# EAGLE design iLight (EAGLE 8.7.0)
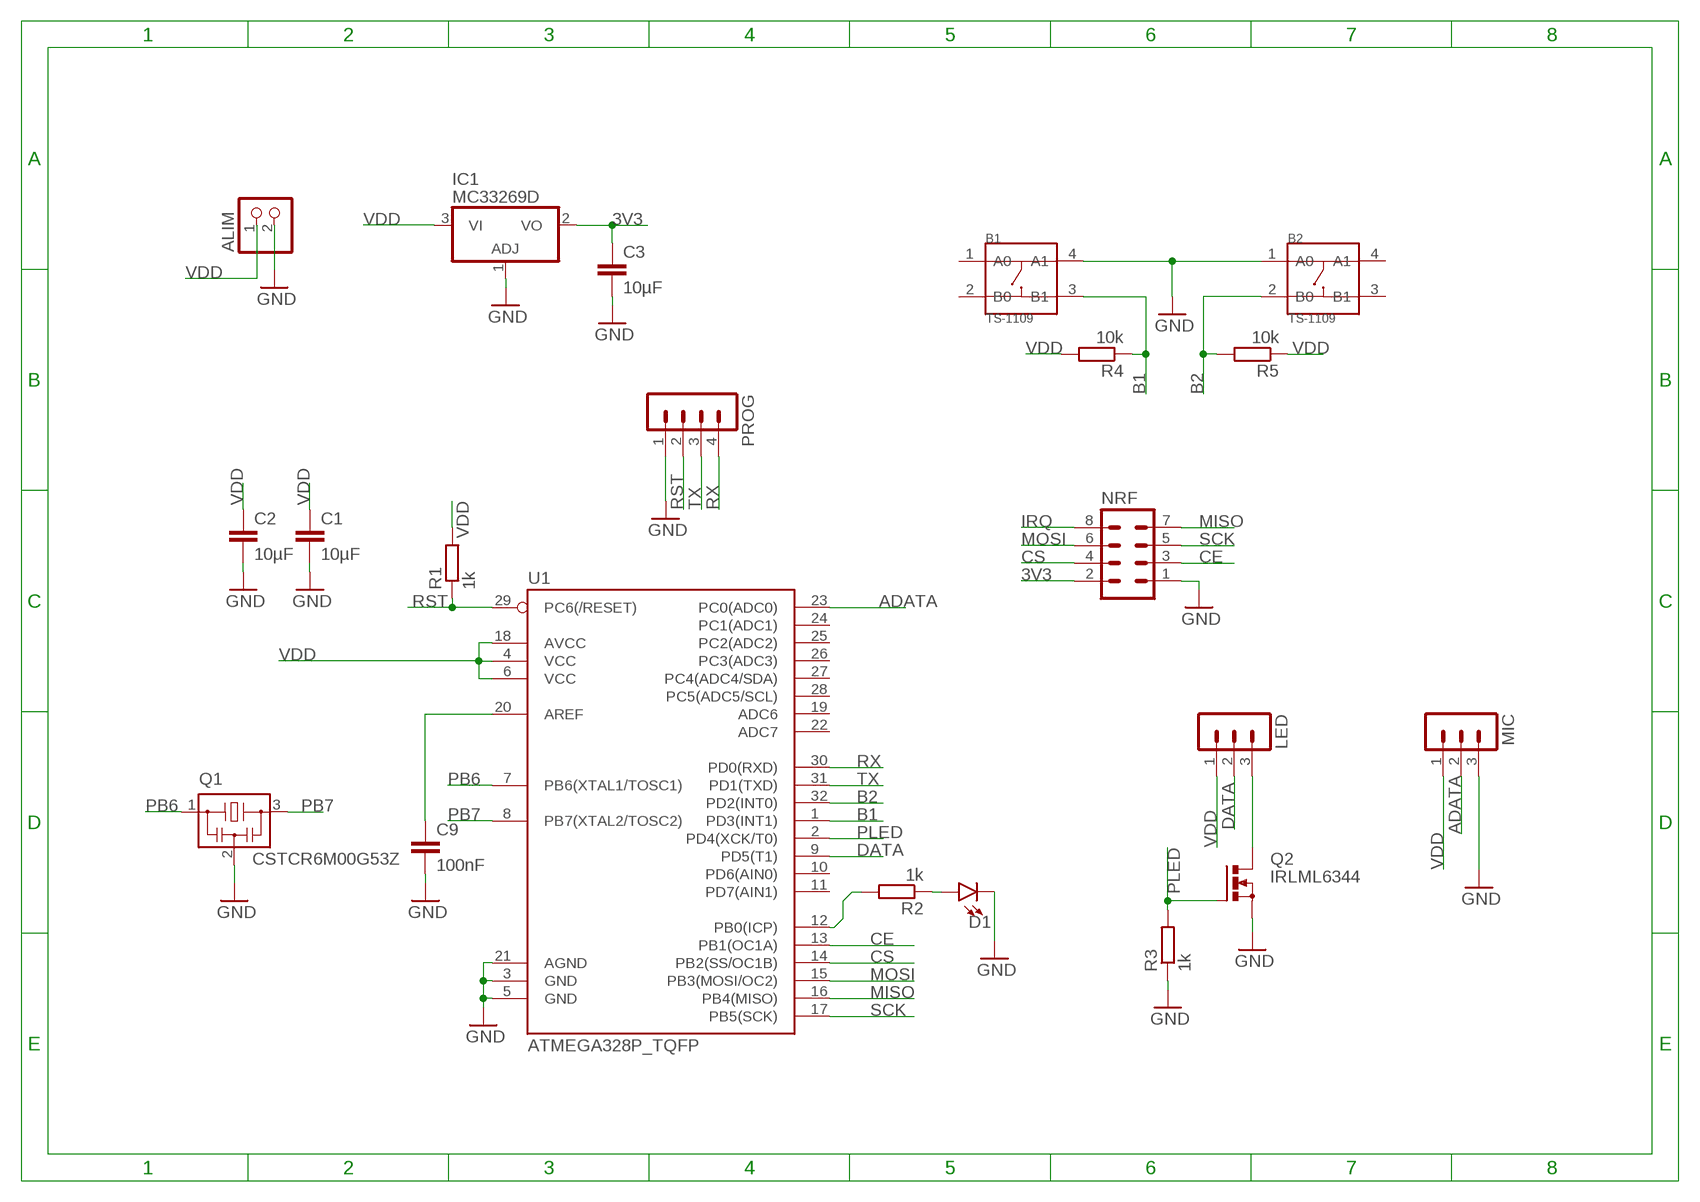
[diagram p0: schematic, sheet 1]

## Parts
ALIM  PINHD-1X2  [1X02]
B1  TS-1109  DIP-BUTTON-4P  [SW4-6.0X6.0X5.0MM]
B2  TS-1109  DIP-BUTTON-4P  [SW4-6.0X6.0X5.0MM]
C1  10µF  C-EUC1206  [C1206]
C2  10µF  C-EUC1206  [C1206]
C3  10µF  C-EUC1206  [C1206]
C9  100nF  C-EUC1206  [C1206]
D1  LED-FKIT-1206  [FKIT-LED-1206]
IC1  MC33269D  [DPACK]
LED  MA03-1  [MA03-1]
MIC  MA03-1  [MA03-1]
NRF  MA04-2  [MA04-2]
PROG  MA04-1  [MA04-1]
Q1  CSTCR6M00G53Z  [CSTCR6M]
Q2  IRLML6344  [SOT-23]
R1  1k  R-EU_R1206  [R1206]
R2  1k  R-EU_R1206  [R1206]
R3  1k  R-EU_R1206  [R1206]
R4  10k  R-EU_R1206  [R1206]
R5  10k  R-EU_R1206  [R1206]
U1  ATMEGA328P_TQFP  [TQFP32-08]

## Nets
3V3: C3.1 IC1.2(VO) NRF.2
ADATA: MIC.2 U1.23(PC0(ADC0))
B1: B1.3(B1) R4.1 U1.1(PD3(INT1))
B2: B2.2(B0) R5.2 U1.32(PD2(INT0))
CE: NRF.3 U1.13(PB1(OC1A))
CS: NRF.4 U1.14(PB2(SS/OC1B))
DATA: LED.2 U1.9(PD5(T1))
GND: ALIM.2 B1.4(A1) B2.1(A0) C1.2 C2.2 C3.2 C9.2 D1.C IC1.1(ADJ) MIC.3 NRF.1 PROG.1 Q1.2 Q2.P2(S) R3.1 U1.3(GND) U1.5(GND) U1.21(AGND)
IRQ: NRF.8
MISO: NRF.7 U1.16(PB4(MISO))
MOSI: NRF.6 U1.15(PB3(MOSI/OC2))
N$1: C9.1 U1.20(AREF)
N$2: LED.3 Q2.P3(D)
N$5: R2.2 U1.12(PB0(ICP))
N$6: D1.A R2.1
PB6: Q1.1 U1.7(PB6(XTAL1/TOSC1))
PB7: Q1.3 U1.8(PB7(XTAL2/TOSC2))
PLED: Q2.P1(G) R3.2 U1.2(PD4(XCK/T0))
RST: PROG.2 R1.1 U1.29(PC6(/RESET))
RX: PROG.4 U1.30(PD0(RXD))
SCK: NRF.5 U1.17(PB5(SCK))
TX: PROG.3 U1.31(PD1(TXD))
VDD: ALIM.1 C1.1 C2.1 IC1.3(VI) LED.1 MIC.1 R1.2 R4.2 R5.1 U1.4(VCC) U1.6(VCC) U1.18(AVCC)
Unconnected: B1.1(A0) B1.2(B0) B2.3(B1) B2.4(A1) U1.10(PD6(AIN0)) U1.11(PD7(AIN1)) U1.19(ADC6) U1.22(ADC7) U1.24(PC1(ADC1)) U1.25(PC2(ADC2)) U1.26(PC3(ADC3)) U1.27(PC4(ADC4/SDA)) U1.28(PC5(ADC5/SCL))

## Library data of the parts
ALIM = pinhead:PINHD-1X2: PIN HEADER
B1 B2 = Seeed-OPL-Button:DIP-BUTTON-4P: 311020024; MPN: TS-1109
C1-C3 C9 = resistor:C-EU: CAPACITOR, European symbol
D1 = SparkFun-LED:LED: LED (Generic) Standard schematic elements and footprints for 5mm, 3mm, 1206, and 0603 sized LEDs. Generic LEDs with no color specified.
IC1 = linear:MC33269?*: Adjustable Output Low Dropout Voltage Regulator 800 mA Source: http://www.onsemi.com/pub/Collateral/MC33269-D.PDF
LED MIC = con-lstb:MA03-1: PIN HEADER; OC_FARNELL: unknown; OC_NEWARK: unknown
NRF = con-lstb:MA04-2: PIN HEADER; OC_FARNELL: unknown; OC_NEWARK: unknown
PROG = con-lstb:MA04-1: PIN HEADER; OC_FARNELL: unknown; OC_NEWARK: unknown
Q1 = murata-filter:CSTCR: Resonator Source: murata.co.jp; MPN: CSTCR6M00G53-R0; OC_FARNELL: 1170434; OC_NEWARK: 25M8759
Q2 = mosfet:IRLML6344: Nch MOSFET IRLML6344 30V 5A http://akizukidenshi.com/catalog/g/gI-06049/ I-06049
R1-R5 = resistor:R-EU_: RESISTOR, European symbol
U1 = SparkFun-IC-Microcontroller:ATMEGA328P_TQFP: Popular 328P in QFP Storefront component: ATmega328 - TQFP <https://www.sparkfun.com/products/13448> (COM-13448) Datasheet <http://www.sparkfun.com/datasheets/Components/SMD/ATMega328.pdf> SparkFun Products SparkFun RedBoard - Programmed with Arduino <https://www.sparkfun.com/products/12757> (DEV-12757) Arduino Pro Mini 328 - 5V/16MHz <https://www.sparkfun.com/products/11113> (DEV-11113) Arduino Pro Mini 328 - 3.3V/8MHz <https://www.sparkfun.com/products/11114> (DEV-11114) SparkFun OpenLog <https://www.sparkfun.com/products/13712> (DEV-13712) SparkFun MicroView - OLED Arduino Module <https://www.sparkfun.com/products/12923> (DEV-12923) SparkFun Digital Sandbox <https://www.sparkfun.com/products/12651> (DEV-12651) SparkFun PicoBoard <https://www.sparkfun.com/products/11888> (WIG-11888) Arduino Fio <https://www.sparkfun.com/products/10116> (DEV-10116) LilyPad Arduino 328 Main Board <https://www.sparkfun.com/products/13342> (DEV-13342) SparkFun RedStick <https://www.sparkfun.com/products/13741> (DEV-13741) LilyPad MP3 <https://www.sparkfun.com/products/11013> (DEV-11013) LilyPad Arduino SimpleSnap <https://www.sparkfun.com/products/10941> (DEV-10941) SparkFun Stepoko <https://www.sparkfun.com/products/13899> (ROB-13899) SparkFun Geiger Counter <https://www.sparkfun.com/products/11345> (SEN-11345) SparkFun EL Sequencer <https://www.sparkfun.com/products/12781> (COM-12781) Arduino Pro 328 - 5V/16MHz <https://www.sparkfun.com/products/10915> (DEV-10915) CryptoCape <https://www.sparkfun.com/products/12773> (DEV-12773) SparkFun IR Thermometer Evaluation Board - MLX90614 <https://www.sparkfun.com/products/10740> (SEN-10740) SparkFun RedBot Mainboard <https://www.sparkfun.com/products/12097> (ROB-12097) Arduino Pro 328 - 3.3V/8MHz <https://www.sparkfun.com/products/10914> (DEV-10914) SparkFun Block for Intel® Edison - Arduino <https://www.sparkfun.com/products/13036> (DEV-13036) SparkFun Simon Says - Surface Mount Soldering Kit <https://www.sparkfun.com/products/10935> (KIT-10935) SparkFun 7-Segment Serial Display - Red <https://www.sparkfun.com/products/11441> (COM-11441) SparkFun 7-Segment Serial Display - White <https://www.sparkfun.com/products/11629> (COM-11629) SparkFun 7-Segment Serial Display - Yellow <https://www.sparkfun.com/products/11443> (COM-11443) SparkFun 7-Segment Serial Display - Kelly Green <https://www.sparkfun.com/products/11440> (COM-11440) SparkFun 7-Segment Serial Display - Blue <https://www.sparkfun.com/products/11442> (COM-11442) SparkFun OpenSegment Serial Display - 20mm (Blue) <https://www.sparkfun.com/products/11647> (COM-11647) SparkFun OpenSegment Serial Display - 20mm (Green) <https://www.sparkfun.com/products/11646> (COM-11646) SparkFun OpenSegment Serial Display - 20mm (White) <https://www.sparkfun.com/products/11648> (COM-11648) SparkFun OpenSegment Serial Display - 20mm (Red) <https://www.sparkfun.com/products/11644> (COM-11644) SparkFun OpenSegment Serial Display - 20mm (Yellow) <https://www.sparkfun.com/products/11645> (COM-11645) SparkFun OpenSegment Shield <https://www.sparkfun.com/products/13190> (DEV-13190); PROD_ID: IC-09069

## Board
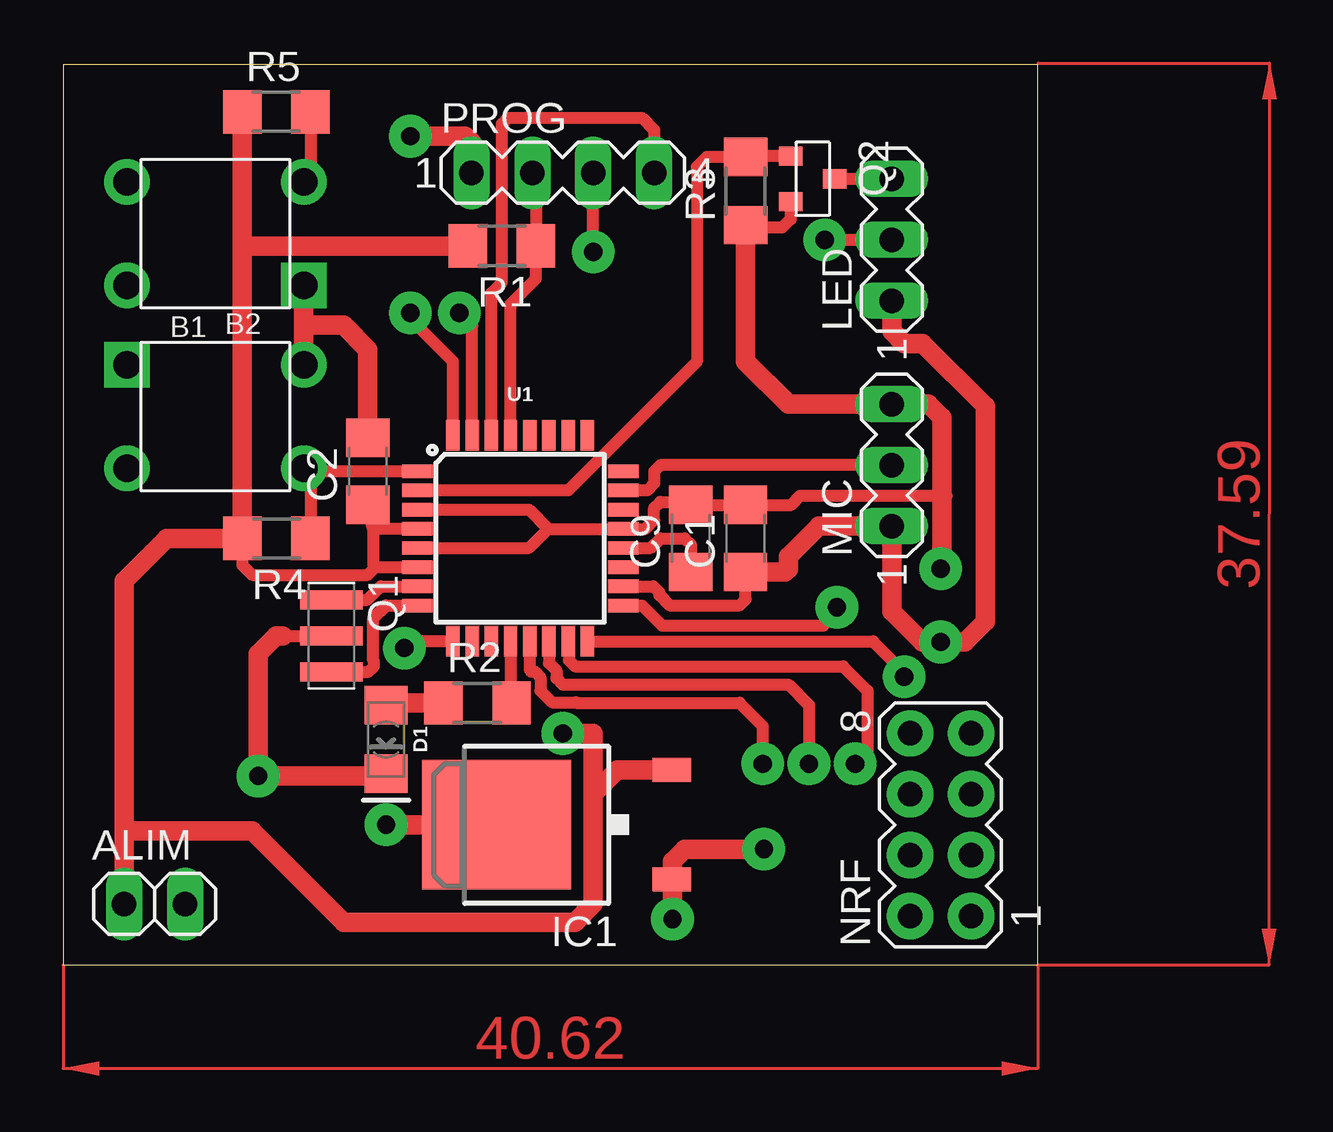
[diagram p1: board, top side]
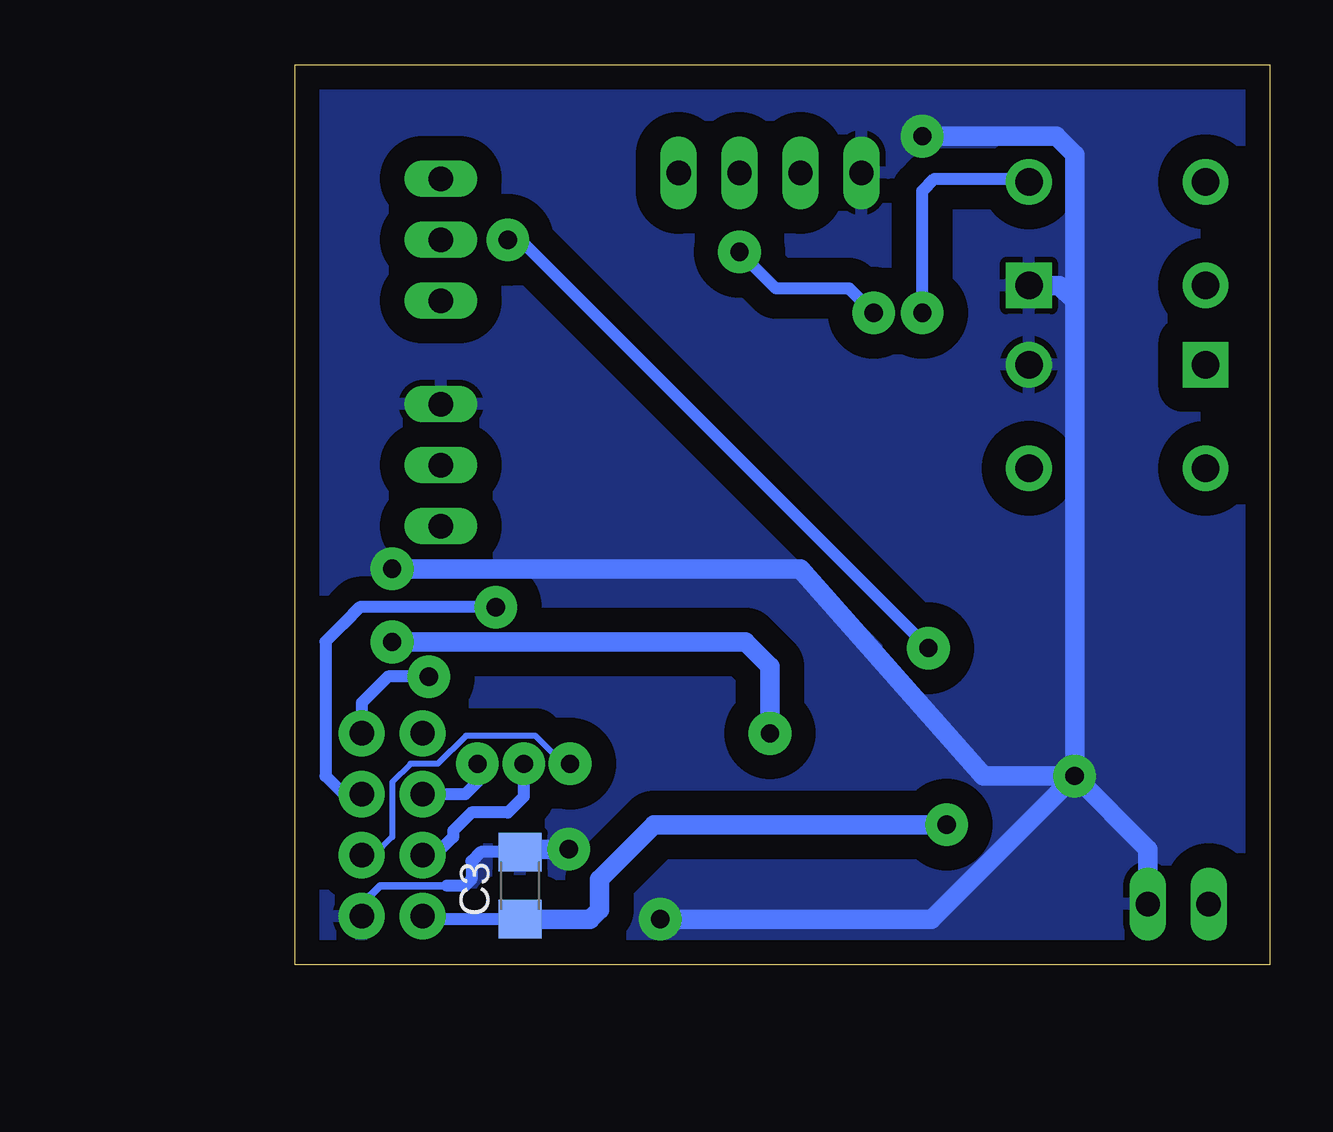
[diagram p2: board, bottom side, seen from below]

Size 40.62 x 37.52 mm. Coordinates in mm from the lower left corner, seen from the top.
Outline: 0,0 40.62,0 40.62,37.52 0,37.52 0,0
Copper layers (1*16): Top 0.035mm / dielectric 1.5mm / Bottom 0.035mm
Design rules "default": minimum track width 6mil, minimum drill 0.35mm, track to track 6mil, track to pad 6mil, pad to pad 6mil, via to via 6mil, smd to smd 6mil, copper to edge 40mil, drill to drill 6mil, minimum pad ring 10mil, minimum via ring 8mil, stop-mask expansion 4mil, vias tented up to drill 0mil, thermal gap 10mil

### Footprints (pad centres in the part's own frame; a part is rotated, then mirrored left to right if it is on the bottom)
1X02 = drill 1.016 long: 1 -1.27,0; 2 1.27,0
SW4-6.0X6.0X5.0MM = drill 1.143 pad 1.905 square: 1 -3.683,2.159 | drill 1.143 pad 1.905: 2 -3.683,-2.159; 3 3.683,-2.159; 4 3.683,2.159
C1206 = smd 1.6 x 1.8: 1 -1.4,0; 2 1.4,0
FKIT-LED-1206 = smd 1.6 x 1.803: A -1.422,0; C 1.422,0
DPACK = smd 1 x 1.6: 1 -2.28,-4.8; 3 2.28,-4.8 | smd 5.4 x 6.2: 2 0,2.5
MA03-1 = drill 1.016 long: 1 -2.54,0; 2 0,0; 3 2.54,0
MA04-2 = drill 1.016 pad 1.93: 1 -3.81,-1.27; 2 -3.81,1.27; 3 -1.27,-1.27; 4 -1.27,1.27; 5 1.27,-1.27; 6 1.27,1.27; 7 3.81,-1.27; 8 3.81,1.27
MA04-1 = drill 1.016 long: 1 -3.81,0; 2 -1.27,0; 3 1.27,0; 4 3.81,0
CSTCR6M = smd 0.8 x 2.6: 1 -1.5,0; 2 0,0; 3 1.5,0
SOT-23 = smd 0.802 x 0.972: P1 -0.95,-0.917; P2 0.95,-0.917; P3 0,0.917
R1206 = smd 1.6 x 1.803: 1 -1.422,0; 2 1.422,0
TQFP32-08 = smd 1.27 x 0.559: 1 -4.293,2.8; 2 -4.293,2; 3 -4.293,1.2; 4 -4.293,0.4; 5 -4.293,-0.4; 6 -4.293,-1.2; 7 -4.293,-2; 8 -4.293,-2.8; 17 4.293,-2.8; 18 4.293,-2; 19 4.293,-1.2; 20 4.293,-0.4; 21 4.293,0.4; 22 4.293,1.2; 23 4.293,2; 24 4.293,2.8 | smd 0.559 x 1.27: 9 -2.8,-4.293; 10 -2,-4.293; 11 -1.2,-4.293; 12 -0.4,-4.293; 13 0.4,-4.293; 14 1.2,-4.293; 15 2,-4.293; 16 2.8,-4.293; 25 2.8,4.293; 26 2,4.293; 27 1.2,4.293; 28 0.4,4.293; 29 -0.4,4.293; 30 -1.2,4.293; 31 -2,4.293; 32 -2.8,4.293

### Placement (x,y rotation side)
ALIM  3.81,2.54 0 top
B1  6.35,22.86 0 top
B2  6.35,30.48 180 top
C1  28.45,17.78 90 top
C2  12.7,20.57 90 top
C3  31.24,3.3 90 bottom
C9  26.16,17.78 90 top
D1  13.46,9.4 270 top
IC1  20.57,5.84 90 top
LED  34.54,30.23 90 top
MIC  34.54,20.83 90 top
NRF  36.58,5.84 90 top
PROG  20.83,33.02 0 top
Q1  11.18,13.72 270 top
Q2  31.24,32.77 270 top
R1  18.29,29.97 180 top
R2  17.27,10.92 0 top
R3  28.45,32.26 90 top
R4  8.89,17.78 180 top
R5  8.89,35.56 0 top
U1  19.05,17.78 0 top

### Tracks (layer width: path | path; a pad name or v marks a point on that pad's centre or on a via)
3V3  (via drill 0.76 pad 1.78)
  Top 0.813: IC1.2 v13.46,5.84
  Bottom 0.508: C3.1 35.18,1.9 NRF.2
  Bottom 0.813: v13.46,5.84 25.65,5.84 27.94,3.56 27.94,2.29 28.32,1.9 C3.1
ADATA
  Top 0.508: MIC.2 24.89,20.83 24.64,20.57 24.64,20.07 24.35,19.78 U1.23
B1
  Top 0.508: U1.1 10.15,20.58 B1.3 10.31,20.42 R4.1
B2  (via drill 0.76 pad 1.78)
  Top 0.508: U1.32 16.25,25.15 14.48,26.92 v14.48,27.18 | R5.2 10.31,32.92 B2.2
  Bottom 0.508: v14.48,27.18 14.48,32.26 13.97,32.77 10.16,32.77 B2.2
CE  (via drill 0.76 pad 1.78)
  Top 0.508: U1.13 19.45,12.3 19.52,12.23 19.66,12.23 19.9,11.99 19.9,11.43 20.38,10.95 21.36,10.95 21.39,10.92 28.19,10.92 29.16,9.96 v29.16,8.38
  Bottom 0.254: v29.16,8.38 29.44,8.38 30.61,9.55 33.5,9.55 34.67,8.38 35.81,8.38 36.58,7.62 36.58,5.33 37.34,4.57 NRF.3
CS  (via drill 0.76 pad 1.78)
  Top 0.508: U1.14 20.25,12.58 20.56,12.27 20.56,11.95 20.83,11.68 30.23,11.68 31.09,10.82 v31.09,8.38
  Bottom 0.508: v31.09,8.38 31.09,7.01 31.75,6.35 33.27,6.35 34.04,5.59 34.04,5.33 34.8,4.57 NRF.4
DATA  (via drill 0.76 pad 1.78)
  Top 0.508: U1.9 14.5,13.49 v14.22,13.21 | v31.75,30.23 LED.2
  Bottom 0.508: v14.22,13.21 31.24,30.23 v31.75,30.23
GND  (via drill 0.76 pad 1.78)
  Top 0.508: U1.5 19.41,17.38 20.21,18.18 | U1.3 19.41,18.98 20.21,18.18 | Q2.P2 30.32,31.09 29.97,30.73 28.55,30.73 R3.1 | 9.14,13.72 Q1.2 | 13.36,7.87 D1.C | 36.83,19.56 36.63,19.56 30.73,19.56 30.36,19.18 C1.2 C9.2 25.78,19.56 25.65,19.56 25.4,19.3 24.89,19.3 24.64,19.05 24.64,18.54 24.28,18.18 U1.21 20.21,18.18
  Top 0.813: 9.14,13.72 8.89,13.72 8.13,12.95 v8.13,7.87 13.36,7.87 | v25.4,1.91 25.4,3.54 IC1.1 25.4,3.59 25.4,4.32 25.91,4.83 v29.21,4.83 | B1.4 10.03,26.67 | 10.03,26.67 B2.1 | R3.1 28.45,25.15 30.23,23.37 MIC.3 36.07,23.37 36.63,22.81 36.63,19.56 36.63,16.56 v36.58,16.51 | v14.48,34.54 16.76,34.54 17.02,34.29 PROG.1 | C2.2 12.7,25.65 11.68,26.67 10.03,26.67
  Bottom 0.305: NRF.1 37.85,2.54 37.08,3.3 34.29,3.3
  Bottom 0.508: C3.2 32.89,4.7 33.27,4.32 33.27,3.56 33.53,3.3 34.29,3.3
  Bottom 0.813: ALIM.2 5.08,4.83 v8.13,7.87 | v8.13,7.87 14.1,1.91 v25.4,1.91 | v29.21,4.83 31.12,4.83 C3.2 | v36.58,16.51 19.56,16.51 11.94,7.87 v8.13,7.87 | v8.13,7.87 8.13,27.69 | B2.1 8.76,28.32 8.13,27.69 | 8.13,27.69 8.13,33.78 8.89,34.54 v14.48,34.54
  pour Bottom (isolate 1.016): 0,37.59 40.64,37.59 40.64,0 0,0
MISO  (via drill 0.76 pad 1.78)
  Top 0.508: U1.16 33.76,13.49 35.05,12.19 v35.05,12.01
  Bottom 0.508: v35.05,12.01 36.75,12.01 37.85,10.92 NRF.7
MOSI  (via drill 0.76 pad 1.78)
  Top 0.508: U1.15 21.08,13.46 21.08,12.7 21.34,12.45 32.51,12.45 33.53,11.43 33.53,8.89 v33.02,8.38
  Bottom 0.508: v33.02,8.38 33.02,7.62 33.53,7.11 NRF.6
N$1
  Top 0.508: U1.20 24.49,17.38 24.89,17.78 25.91,17.78 26.16,17.53 C9.1
N$2
  Top 0.508: Q2.P3 LED.3
N$5
  Top 0.508: U1.12 18.65,10.97 R2.2
N$6
  Top 0.813: D1.A 13.56,10.92 R2.1
PB6
  Top 0.508: Q1.1 12.68,15.22 13.24,15.78 U1.7
PB7
  Top 0.508: Q1.3 12.72,12.22 12.95,12.45 12.95,12.65 12.93,12.67 12.93,14.45 13.46,14.99 13.47,14.98 U1.8
PLED
  Top 0.508: Q2.P1 28.48,33.72 R3.2 26.82,33.68 26.42,33.27 26.42,25.15 21.05,19.78 U1.2
RST
  Top 0.508: U1.29 18.65,27.54 19.71,28.6 R1.1 19.71,32.87 PROG.2
RX
  Top 0.508: U1.30 17.85,28.01 18.29,28.45 18.29,35.05 18.54,35.31 24.13,35.31 24.64,34.8 PROG.4
SCK  (via drill 0.76 pad 1.78)
  Top 0.508: U1.17 24.14,14.98 24.97,14.15 31.67,14.15 32.26,14.73 v32.26,14.91
  Bottom 0.508: v32.26,14.91 37.92,14.91 38.59,14.24 | 38.59,14.24 38.59,14.22 | 38.59,14.24 39.35,13.48 39.35,7.87 38.59,7.11 NRF.5
TX  (via drill 0.76 pad 1.78)
  Top 0.508: U1.31 17.05,26.64 v16.51,27.18 | v22.1,29.72 PROG.3
  Bottom 0.508: v16.51,27.18 17.53,28.19 20.57,28.19 v22.1,29.72
VDD  (via drill 0.76 pad 1.78)
  Top 0.508: U1.4 12.93,18.18 | 12.93,18.18 C2.1 | R4.2 7.47,16.66 7.87,16.26 12.7,16.26 13.02,16.58 | 13.02,16.58 U1.6 | 12.93,18.18 12.93,16.67 13.02,16.58 | U1.18 24.61,15.78 24.86,15.53 24.86,15.41 25.28,14.99 28.19,14.99 28.45,15.24 C1.1
  Top 0.813: ALIM.1 2.54,5.59 | 2.54,5.59 2.54,16 4.32,17.78 R4.2 7.47,29.97 | 7.47,29.97 R5.1 | R1.2 7.47,29.97 | IC1.3 23.11,8.12 22.1,7.11 | 22.1,7.11 22.1,2.54 21.34,1.78 11.68,1.78 7.87,5.59 2.54,5.59 | C1.1 30.1,16.38 30.23,16.51 30.23,17.02 31.5,18.29 MIC.1 34.54,14.73 35.81,13.46 v36.58,13.46 37.59,13.46 38.44,14.31 38.44,23.29 35.81,25.91 35.05,25.91 34.54,26.42 LED.1 | v20.83,9.65 22.1,9.65 22.1,7.11
  Bottom 0.813: v36.58,13.46 21.84,13.46 20.83,12.45 v20.83,9.65
(copper drawn outside any net)
  shapes: Top area x2